# Altium project GJJ真正的大作业.PrjPcb
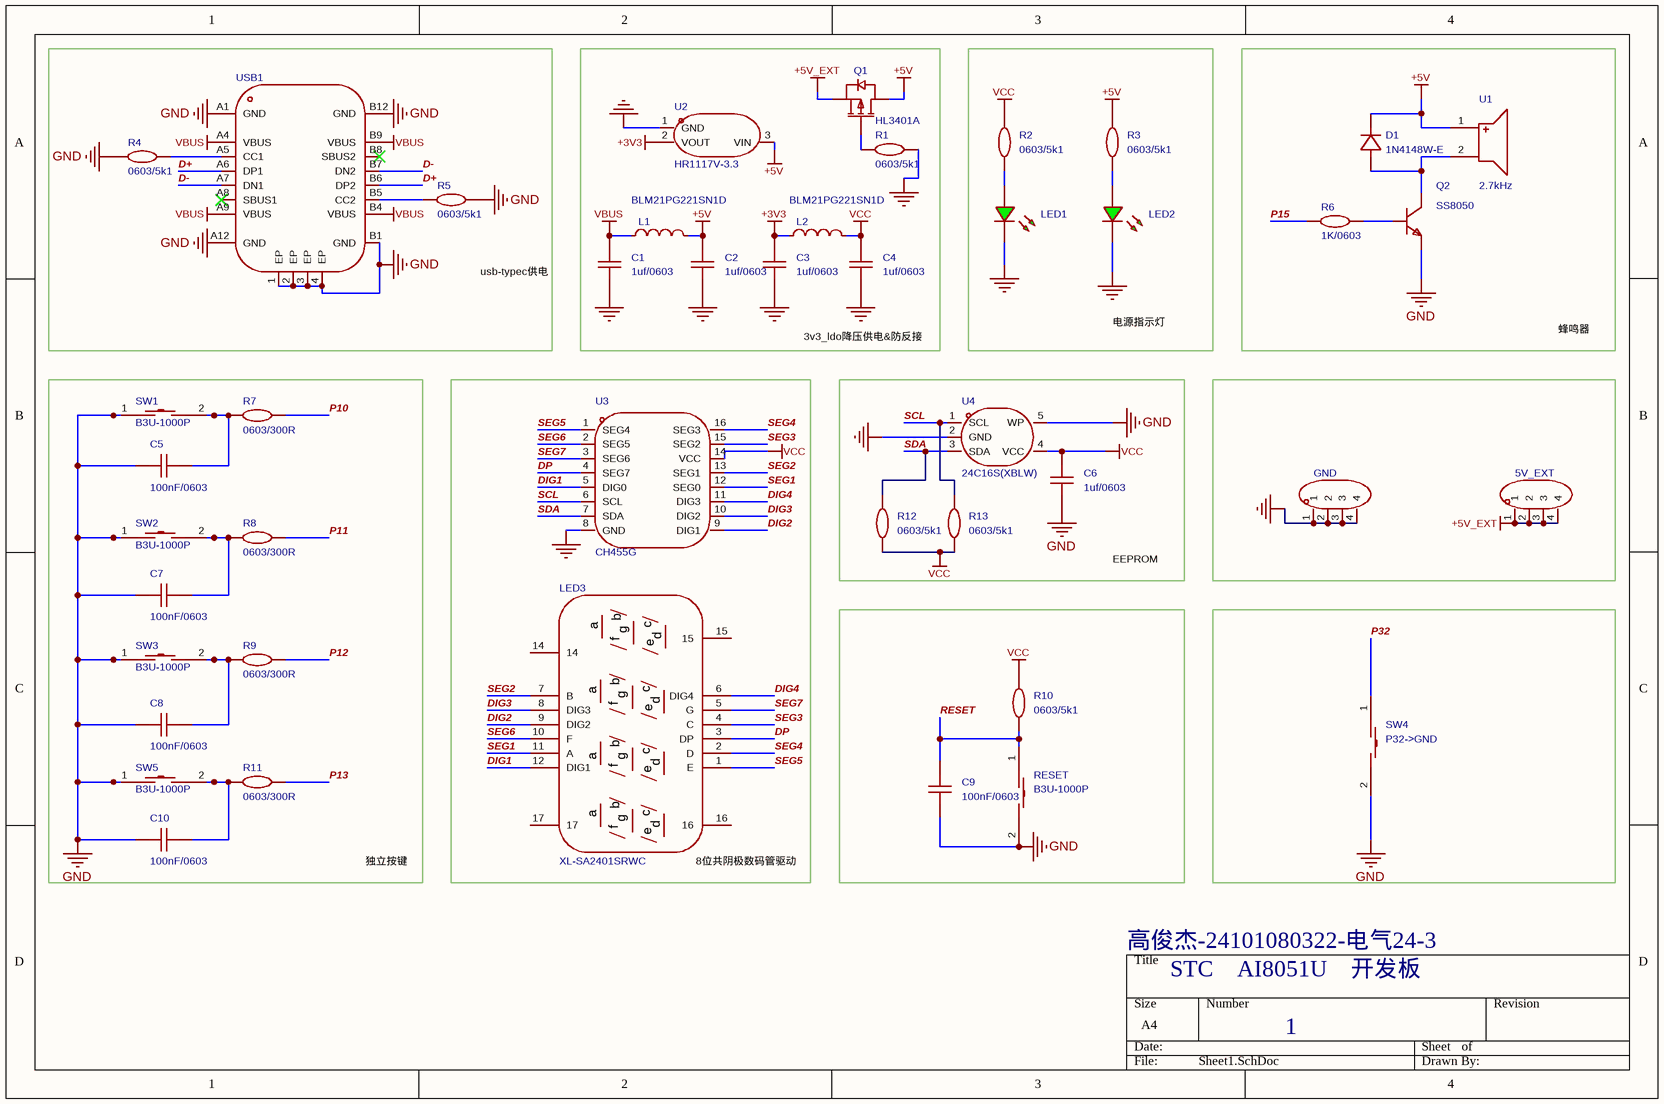
[diagram p0: Sheet1.SchDoc]
2 sheets, 48 parts. Net scope: global (net labels, ports and power ports of the same name join across sheets).
Board file: PCB1.PcbDoc
Sheets:
  Sheet1.SchDoc
  Sheet2.SchDoc

## Sheet Sheet1.SchDoc
size A4; SheetNumber: 1; SheetTotal: 2

### Parts
5V_EXT  (no value)  [HDR-TH_4P-P2.54-V-F]
C1  1uf/0603  [C0603]
C2  1uf/0603  [C0603]
C3  1uf/0603  [C0603]
C4  1uf/0603  [C0603]
C5  100nF/0603  [C0603]
C6  1uf/0603  [C0603]
C7  100nF/0603  [C0603]
C8  100nF/0603  [C0603]
C9  100nF/0603  [C0603]
C10  100nF/0603  [C0603]
D1  1N4148W-E  [SOD-123_L2.8-W1.6-LS3.7-RD]
GND  (no value)  [HDR-TH_4P-P2.54-V-F]
L1  BLM21PG221SN1D  [L0805]
L2  BLM21PG221SN1D  [L0805]
LED1  (no value)  [LED_0603]
LED2  (no value)  [LED_0603]
LED3  XL-SA2401SRWC  [LED-SEG-SMD_12P-L28.5-W10.0-P2.54]
Q1  HL3401A  [SOT-23-3_L2.9-W1.3-P1.90-LS2.4-BR]
Q2  SS8050  [SOT-23-3_L2.9-W1.3-P1.90-LS2.4-BR]
R1  0603/5k1  [R0603]
R2  0603/5k1  [R0603]
R3  0603/5k1  [R0603]
R4  0603/5k1  [R0603]
R5  0603/5k1  [R0603]
R6  1K/0603  [R0603]
R7  0603/300R  [R0603]
R8  0603/300R  [R0603]
R9  0603/300R  [R0603]
R10  0603/5k1  [R0603]
R11  0603/300R  [R0603]
R12  0603/5k1  [R0603]
R13  0603/5k1  [R0603]
RESET  B3U-1000P  [KEY-SMD_B3U-1000PM]
SW1  B3U-1000P  [KEY-SMD_B3U-1000PM]
SW2  B3U-1000P  [KEY-SMD_B3U-1000PM]
SW3  B3U-1000P  [KEY-SMD_B3U-1000PM]
SW4  P32->GND  [KEY-SMD_B3U-1000PM]
SW5  B3U-1000P  [KEY-SMD_B3U-1000PM]
U1  2.7kHz  [BUZ-SMD_L9.7-W9.7]
U2  HR1117V-3.3  [SOT-89-3_L4.5-W2.4-P1.50-LS4.0-BR]
U3  CH455G  [SOP-16_L10.0-W3.9-P1.27-LS6.0-BL]
U4  24C16S(XBLW)  [SOT-23-5_L2.9-W1.6-P0.95-LS2.8-BL]
USB1  (no value)  [USB_TYPE-C-16P]

### Blocks framed on the sheet
usb-typec供电: R4 R5 USB1
3v3_ldo降压供电&防反接: C1-C4 L1 L2 Q1 R1 U2
电源指示灯: LED1 LED2 R2 R3
蜂鸣器: D1 Q2 R6 U1
独立按键: C5 C7 C8 C10 R7-R9 R11 SW1-SW3 SW5
8位共阴极数码管驱动: LED3 U3
EEPROM: C6 R12 R13 U4

### Nets
+3V3: C3.2 L2.1 U2.2(VOUT)
+5V: C2.2 D1.1(C) L1.2 Q1.3(D) R3.2 U1.1 U2.3(VIN)
+5V_EXT: 5V_EXT.1 5V_EXT.2 5V_EXT.3 5V_EXT.4 Q1.2(S)
GND: C1.1 C2.1 C3.1 C4.1 C5.1 C6.1 C7.1 C8.1 C9.1 C10.1 GND.1 GND.2 GND.3 GND.4 LED1.1(C) LED2.1(C) Q2.2(E) R1.2 R4.1 R5.2 RESET.2 SW1.1 SW2.1 SW3.1 SW4.2 SW5.1 U2.1(GND) U3.8(GND) U4.2(GND) U4.5(WP) USB1.1(EP) USB1.2(EP) USB1.3(EP) USB1.4(EP) USB1.A1(GND) USB1.A12(GND) USB1.B1(GND) USB1.B12(GND)
VBUS: C1.2 L1.1 USB1.A4(VBUS) USB1.A9(VBUS) USB1.B4(VBUS) USB1.B9(VBUS)
VCC: C4.2 C6.2 L2.2 R2.2 R10.2 R12.1 R13.1 U3.14(VCC) U4.4(VCC)
D+: USB1.A6(DP1) USB1.B6(DP2)
D-: USB1.A7(DN1) USB1.B7(DN2)
DIG1: LED3.12(DIG1) U3.5(DIG0)
DIG2: LED3.9(DIG2) U3.9(DIG1)
DIG3: LED3.8(DIG3) U3.10(DIG2)
DIG4: LED3.6(DIG4) U3.11(DIG3)
DP: LED3.3(DP) U3.4(SEG7)
P10: R7.2
P11: R8.2
P12: R9.2
P13: R11.2
P15: R6.1
P32: SW4.1
RESET: C9.2 R10.1 RESET.1
SCL: R13.2 U3.6(SCL) U4.1(SCL)  [project net P24]
SDA: R12.2 U3.7(SDA) U4.3(SDA)  [project net P23]
SEG1: LED3.11(A) U3.12(SEG0)
SEG2: LED3.7(B) U3.13(SEG1)
SEG3: LED3.4(C) U3.15(SEG2)
SEG4: LED3.2(D) U3.16(SEG3)
SEG5: LED3.1(E) U3.1(SEG4)
SEG6: LED3.10(F) U3.2(SEG5)
SEG7: LED3.5(G) U3.3(SEG6)
NetC5_2: C5.2 R7.1 SW1.2
NetC7_2: C7.2 R8.1 SW2.2
NetC8_2: C8.2 R9.1 SW3.2
NetC10_2: C10.2 R11.1 SW5.2
NetD1_2: D1.2(A) Q2.3(C) U1.2
NetLED1_2: LED1.2(A) R2.1
NetLED2_2: LED2.2(A) R3.1
NetQ1_1: Q1.1(G) R1.1
NetQ2_1: Q2.1(B) R6.2
NetR4_2: R4.2 USB1.A5(CC1)
NetR5_1: R5.1 USB1.B5(CC2)

Not connected (* = marked no-connect by the designer): LED3 14 15 16 17; USB1 A8(SBUS1)* B8(SBUS2)*

### Notes on the sheet
- 高俊杰-24101080322-电气24-3
- STC    AI8051U    开发板
- 1
- (in symbol XL-SA2401SRWC) b; a; g; c; f; d; e

### Library data of the parts
5V_EXT GND = HDR-F_2.54_1x4P: Symbol: 2.54-1*4P母; ConvertToPcb: yes; ModelId: d187812051054f85879fcaa51a310d8e聨0819f05c4eef4c71ace90d822a990e87; ModelTransform: 419.6842,98.464,0,0,0,0,0,0,-118.11; Device: HDR-F_2.54_1x4P; AddInBom: yes; SupplierPart: C2718488; Supplier Footprint: 插件; FootprintName: HDR-TH_4P-P2.54-V-F; ModelName: HDR-TH_4P-P2.54-V-F
C1-C10 = CAP_0603: Symbol: Capacitance; 3D Model: ac125912035d415993ca9572d50418b1聨0819f05c4eef4c71ace90d822a990e87; 3D Model Transform: 62.992,31.496,0,0,0,0,0,0,0; ConvertToPcb: yes; ModelName: C0603_L1.6-W0.8-H0.8; Device: CAP_0603; Supplier Footprint: 0603; AddInBom: yes; FootprintName: C0603
  C1-C4 C6: Value: 1uf/0603
  C5 C7-C10: Value: 100nF/0603
D1 = 1N4148W-E: 二极管配置:-;正向压降(Vf):-;直流反向耐压(Vr):-;; Manufacturer: MDD(辰达半导体); 3D Model: 73858e86c18848f5a81710cfe7352ee5; 3D Model Transform: 145.669,70.3249,0,0,0,0,0,0,0; AddInBom: yes; Symbol: 1n4148w-e; Device: 1N4148W-E; LCSC Part Name: 开关二极管; Supplier Part: C41371420; Manufacturer Part: 1N4148W-E; Supplier Footprint: SOD-123; JLCPCB Part Class: 扩展库; Datasheet: https://atta.szlcsc.com/upload/public/pdf/source/20240830/DACFAB1CEFECD76C0C0B0085B83E27DC.pdf; Supplier: LCSC; Diode Configuration: -; Forward Voltage (Vf@If): -; Reverse Voltage (Vr): -; ConvertToPcb: yes; FootprintName: SOD-123_L2.8-W1.6-LS3.7-RD; ModelName: SOD-123_L2.8-W1.6-LS3.7-RD
L1 L2 = BLM21PG221SN1D: 阻抗@频率:220Ω@100MHz;误差:±25%;直流电阻(DCR):45mΩ;; Manufacturer: muRata(村田); AddInBom: yes; ModelId: 37a81e68749a4138bd2dfa6897b24b85聨0819f05c4eef4c71ace90d822a990e87; ModelName: R0805_L2.0-W1.3-H0.6; ModelTransform: 78.74,51.181,0,0,0,0,0,0.001,0; Tolerance: ±25%; DC Resistance(DCR): 45mΩ; Current Rating: 2A; Number of Circuits: 1; Symbol: BLM21PG221SN1D; Device: BLM21PG221SN1D; LCSC Part Name: 单路 0805磁珠 阻抗220Ω@100MHz; SupplierPart: C85840; ManufacturerPart: BLM21PG221SN1D; Supplier Footprint: 0805; JLCPCB Part Class: Extended Part; Datasheet: https://item.szlcsc.com/datasheet/BLM21PG221SN1D/87016.html; Supplier: LCSC; ConvertToPcb: yes; FootprintName: L0805; Impedance @ Frequency: 220Ω@100MHz; Operating Temperature: -55℃~+125℃
LED1 LED2 = LED_0603-G: Symbol: LED_G_OLD; Convert to PCB: yes; 3D Model: 8b5fcaf0229049f8a37a9c352bb0ca0a聨0819f05c4eef4c71ace90d822a990e87; 3D Model Transform: 63.1,31.6,23.7,0,0,0,0,0,0; ModelName: LED-0603_G; Device: LED_0603-G; Add into BOM: yes; Supplier Footprint: 0603; FootprintName: LED_0603
LED3 = XL-SA2401SRWC: 数码管位数:4位;字符尺寸(英寸):0.2;LED极性:共阴;发光颜色:红色;耗散功率(Pd):36mW;; Manufacturer: XINGLIGHT(成兴光); AddInBom: yes; ModelId: 84030f14c7a848788791f3033a3ddaf3聨0819f05c4eef4c71ace90d822a990e87; ModelTransform: 1122.045,393.7,0,0,0,0,0,0,0; Number of Characters: 4位; Digit/Alpha Size(inch): 0.2; Display Type: 7段; LED Polarity: 共阴; Illumination Color: 红色; Light Intensity: 100mcd; Forward Voltage Drop: 1.8V; Pd - Power Dissipation: 36mW; Symbol: XL-SA2401SRWC; Device: XL-SA2401SRWC; LCSC Part Name: 0.2英寸红色四位共阴数码管; SupplierPart: C49652871; ManufacturerPart: XL-SA2401SRWC; Supplier Footprint: SMD; JLCPCB Part Class: Extended Part; Datasheet: https://item.szlcsc.com/datasheet/XL-SA2401SRWC/52210392.html; Supplier: LCSC; ConvertToPcb: yes; FootprintName: LED-SEG-SMD_12P-L28.5-W10.0-P2.54; ModelName: LED-SEG-SMD_12P-L28.5-W10.0-P2.54; Operating Temperature: -30℃~+70℃; Length: -; Width: -; Height: -
Q1 = HL3401A: 数量:1个P沟道;漏源电压(Vdss):30V;连续漏极电流(Id):4.2A;导通电阻(RDS(on)):50mΩ@10V;耗散功率(Pd):350mW;阈值电压(Vgs(th)):900mV@250uA;; Manufacturer: R+O(宏嘉诚); AddInBom: yes; ModelId: c62791f0466c4ae2a892c056b845b0ca聨0819f05c4eef4c71ace90d822a990e87; ModelName: SOT-23-3P_L2.9-W1.3-H1.0-LS2.4-P0.95; ModelTransform: 98.425,114.173,0,180,0,0,0.0005,-0.0005,0; Number: 1个P沟道; Drain to Source Voltage: 30V; Current - Continuous Drain(Id): 4.2A; Pd - Power Dissipation: 350mW; Gate Charge(Qg): 22nC@10V; Input Capacitance(Ciss): 954pF; Reverse Transfer Capacitance (Crss@Vds): 77pF; Type: P沟道; Output Capacitance(Coss): 115pF; Symbol: HL3401A; Device: HL3401A; LCSC Part Name: 1个P沟道 耐压:30V 电流:4.2A; SupplierPart: C7420349; ManufacturerPart: HL3401A; Supplier Footprint: SOT-23; JLCPCB Part Class: Extended Part; Datasheet: https://item.szlcsc.com/datasheet/HL3401A/8397171.html; Supplier: LCSC; ConvertToPcb: yes; FootprintName: SOT-23-3_L2.9-W1.3-P1.90-LS2.4-BR; RDS(on): 50mΩ@10V; Gate Threshold Voltage (Vgs(th)): 900mV@250uA; Operating Temperature: -55℃~+150℃
Q2 = SS8050_C2150: 晶体管类型:NPN;集电极电流(Ic):1.5A;集射极击穿电压(Vceo):25V;功率(Pd):300mW;直流电流增益(hFE@Ic,Vce):200@100mA,1V;; Manufacturer: CJ(江苏长电/长晶); 3D Model: c62791f0466c4ae2a892c056b845b0ca; 3D Model Transform: 98.425,114.173,0,180,0,0,0.0005,-0.0005,0; Transistor Type: NPN; Collector Current (Ic): 1.5A; Collector-Emitter Breakdown Voltage (Vceo): 25V; Power Dissipation (Pd): 300mW; Transition Frequency (fT): 100MHz; Collector Cut-Off Current (Icbo): 100nA; Collector-Emitter Saturation Voltage (VCE(sat)@Ic,Ib): 500mV@800mA,80mA; AddInBom: yes; ModelName: SOT-23-3P_L2.9-W1.3-H1.0-LS2.4-P0.95; Symbol: SS8050_C2150; Device: SS8050_C2150; LCSC Part Name: SS8050(RANGE:200-350) hfe=200~350; Supplier Part: C2150; Manufacturer Part: SS8050; Supplier Footprint: SOT-23; Datasheet: https://atta.szlcsc.com/upload/public/pdf/source/20230322/AEE86F4B043774EFF80CAEA14A37D9E9.pdf; Supplier: LCSC; DC Current Gain (hFE@Ic,Vce): 200@100mA,1V; Operating Temperature: -; ConvertToPcb: yes; FootprintName: SOT-23-3_L2.9-W1.3-P1.90-LS2.4-BR
R1-R13 = Res_0603: Symbol: 电阻; ConvertToPcb: yes; ModelId: fc143cca1e79419f9cd78b61e9279f08聨0819f05c4eef4c71ace90d822a990e87; ModelTransform: 31.8897,63.7794,0,90,0,0,0,0,0; Device: Res_0603; AddInBom: yes; Supplier Footprint: 0603; FootprintName: R0603; ModelName: R0603
  R1-R5 R10 R12 R13: Value: 0603/5k1
  R6: Value: 1K/0603
  R7-R9 R11: Value: 0603/300R
RESET SW1-SW5 = B3U-1000P: 电路结构:单刀单掷;按钮形状:圆形按钮;作用力:1.53N;安装方式:立贴;开关长度:3mm;开关宽度:2.5mm;开关高度:1.6mm;触点电流:50mA;额定电压:12V;带灯:-;工作寿命:-;; Manufacturer: OMRON(欧姆龙); AddInBom: yes; ModelId: 4a122f942e8c428cab657e97b0b9ae70聨0819f05c4eef4c71ace90d822a990e87; ModelName: KEY-SMD_2P-L3.0-W2.5-H1.6-LS4.0; ModelTransform: 157.48,98.425,0,0,0,0,0,0,0; Circuit: 单刀单掷; Actuator Style: 圆形按钮; Operating Force: 1.53N; Switch Height: 1.6mm; Contact Current: 50mA; Voltage Rating: 12V; Symbol: B3U-1000P; Device: B3U-1000P; LCSC Part Name: 3*2.5*1.6mm 立贴 轻触开关; SupplierPart: C231329; ManufacturerPart: B3U-1000P; Supplier Footprint: SMD,2.5x3mm; JLCPCB Part Class: Extended Part; Datasheet: https://item.szlcsc.com/datasheet/B3U-1000P/231216.html; Supplier: LCSC; ConvertToPcb: yes; FootprintName: KEY-SMD_B3U-1000PM; Mounting Type: 立贴; Length: 3mm; Width: 2.5mm; With Lamp: -; Termination Style: SMD接片; Life: -; Operating Temperature: -25℃~+70℃
U1 = CMI-9705-0580-SMT-TR: 驱动方式:有源(内含驱动线路);构造类型:电磁式;额定电压:5V;频率:2.7kHz;声压(SPL):80dB;; Manufacturer: CUI; AddInBom: yes; ModelId: 4d30b5b9f6214c52b026a489d6e841ad聨0819f05c4eef4c71ace90d822a990e87; ModelTransform: 382.283,397.637,0,0,0,0,0,-0.001,0; Voltage Rating: 5V; Voltage - Supply: 3V~8V; Current Consumption: 30mA; Sound Pressure Level(SPL): 80dB; Symbol: CMI-9705-0580-SMT-TR; Device: CMI-9705-0580-SMT-TR; LCSC Part Name: 磁性蜂鸣器指示器，表面贴装，内部驱动; SupplierPart: C22359716; ManufacturerPart: CMI-9705-0580-SMT-TR; Supplier Footprint: SMD,9.7x9.7mm; JLCPCB Part Class: Extended Part; Datasheet: https://item.szlcsc.com/datasheet/CMI-9705-0580-SMT-TR/23802189.html; Supplier: LCSC; ConvertToPcb: yes; FootprintName: BUZ-SMD_L9.7-W9.7; ModelName: BUZ-SMD_L9.7-W9.7; Driver Circuitry: 有源(内含驱动线路); Technology: 电磁式; Value: 2.7kHz; Diameter(φD): -; Length: -; Width: -; Height: -; Operating Temperature: -; Mounting Type: -; Lead Pitch: -; Continuous Operating Time: -
U2 = HR1117V-3.3: 输出极性:正极;工作电压:15V;输出电压:3.3V;输出电流:1A;电源纹波抑制比(PSRR):-;输出类型:固定;; Manufacturer: R+O(宏嘉诚); AddInBom: yes; ModelId: dde435042bae4b9691e74da94cf9d9f3聨0819f05c4eef4c71ace90d822a990e87; ModelTransform: 177.165,161.417,0,90,0,0,-2.323,0,0; Output Configuration: 正极; Voltage - Supply: 15V; Output Voltage: 3.3V; Output Current: 1A; Voltage Dropout: 1.1V@(1A); standby current: 2mA; Noise: 0.003%Vout; Output Type: 固定; Number of Outputs: 1; Symbol: HR1117V-3.3; Device: HR1117V-3.3; LCSC Part Name: 低压差线性稳压器，分固定电压输出和可调电压输出版本; SupplierPart: C54560864; ManufacturerPart: HR1117V-3.3; Supplier Footprint: SOT-89; JLCPCB Part Class: Extended Part; Datasheet: https://item.szlcsc.com/datasheet/HR1117V-3.3/57930308.html; Supplier: LCSC; ConvertToPcb: yes; FootprintName: SOT-89-3_L4.5-W2.4-P1.50-LS4.0-BR; ModelName: SOT-89-3_L4.5-W2.4-P1.50-LS4.0-BR; Power Supply Rejection Ratio (PSRR): -; Features: 热关断; Operating Temperature: -40℃~+85℃
U3 = CH455G: 接口类型:I2C;工作电压:2.7V~5V;时钟频率(fc):4MHz;位驱动电流:160mA;段驱动电流:25mA;; Manufacturer: WCH(南京沁恒); AddInBom: yes; ModelId: 3361a6792abf4a8f8fbca4f1924a67ee聨0819f05c4eef4c71ace90d822a990e87; ModelName: SOP-16_L9.9-W3.9-H1.5-LS6.0-P1.27; ModelTransform: 240.39054,393.7,0,90,0,0,0,0,0; Configuration: 7段x4位；8段x4位; Interface: I2C; Clock Frequency: 4MHz; Quiescent Current: 50uA; Digit Drive Current: 160mA; Segment Drive Current: 25mA; Symbol: CH455G; Device: CH455G; LCSC Part Name: 数码管驱动及键盘控制芯片; SupplierPart: C89818; ManufacturerPart: CH455G; Supplier Footprint: SOP-16; JLCPCB Part Class: Extended Part; Datasheet: https://item.szlcsc.com/datasheet/CH455G/91000.html; Supplier: LCSC; ConvertToPcb: yes; FootprintName: SOP-16_L10.0-W3.9-P1.27-LS6.0-BL; Voltage - Supply: 2.7V~5V; Features: 键盘扫描；共阴极；辉光可调; Operating Temperature: -40℃~+85℃; Pd - Power Dissipation: -
U4 = 24C16S(XBLW): 接口类型:I2C;存储容量:16Kbit;时钟频率(fc):1MHz;; Manufacturer: XBLW(芯伯乐); AddInBom: yes; ModelId: 018c57e721114987ae90467fe9f1d259聨0819f05c4eef4c71ace90d822a990e87; ModelTransform: 114.96,110.236,0,0,0,0,0,0,0; Interface: I2C; Memory Size: 16Kbit; Clock Frequency: 1MHz; Write Cycle Time(Tw): 5ms; Data Retention - TDR (Year): 100年; Write Cycle Endurance: 100万次; Voltage - Supply: 1.8V~5.5V; Symbol: 24C16S(XBLW); Device: 24C16S(XBLW); LCSC Part Name: 16Kbit 串行EEPROM; SupplierPart: C41408503; ManufacturerPart: 24C16S(XBLW); Supplier Footprint: SOT-23-5; JLCPCB Part Class: Extended Part; Datasheet: https://item.szlcsc.com/datasheet/24C16S(XBLW)/43210132.html; Supplier: LCSC; ConvertToPcb: yes; FootprintName: SOT-23-5_L2.9-W1.6-P0.95-LS2.8-BL; ModelName: SOT-23-5_L2.9-W1.6-P0.95-LS2.8-BL; Features: 内置上电复位(POR)；硬件写保护功能；噪声抑制功能; Operating Temperature: -40℃~+85℃
USB1 = USB_TYPE-C-16P: AddInBom: yes; ModelId: 35058e297fd54ee2afd2de30c3ce7155聨0819f05c4eef4c71ace90d822a990e87; ModelName: USB-C_SMD-TYPE-C-31-M-12; ModelTransform: 360,318.121,0,180,0,0,0,-41.02,-39.37; Symbol: USB_TYPE-C-16P; Device: USB_TYPE-C-16P; Supplier Footprint: SMD; ConvertToPcb: yes; FootprintName: USB_TYPE-C-16P

## Sheet Sheet2.SchDoc
size A4; SheetNumber: 2; SheetTotal: 2
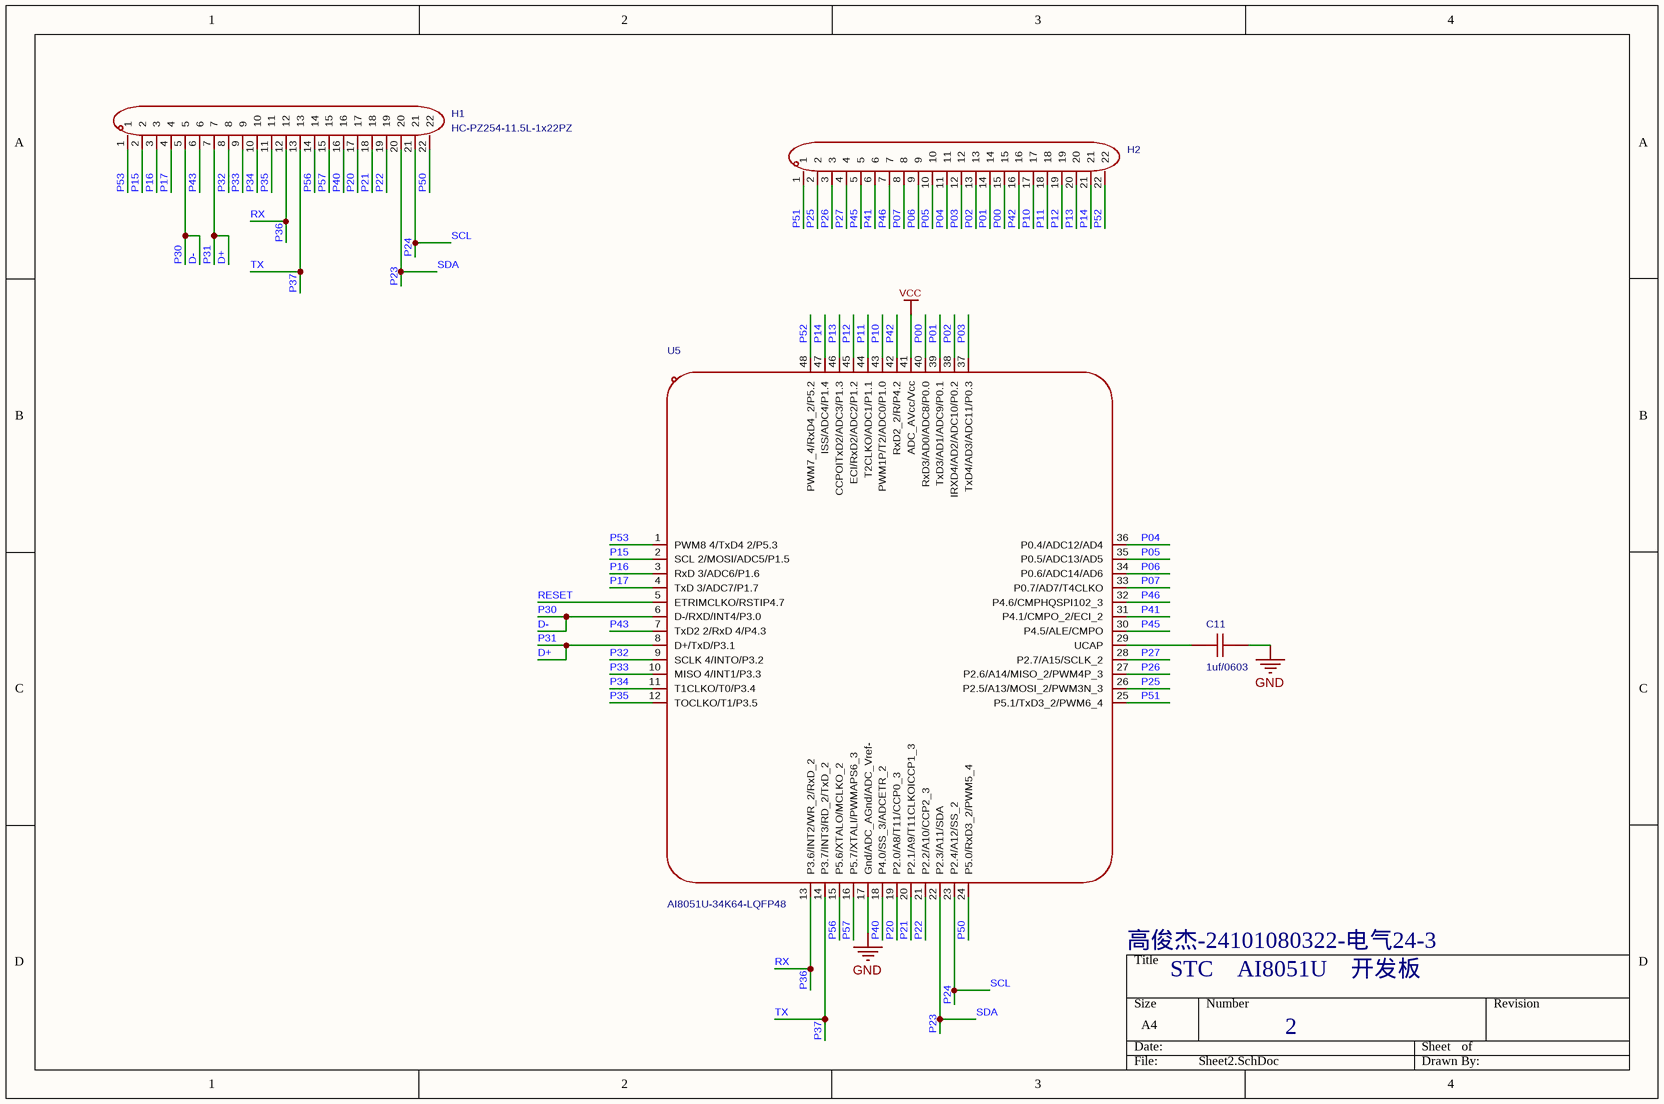
[diagram p1: Sheet2.SchDoc]

### Parts
C11  1uf/0603  [C0603]
H1  HC-PZ254-11.5L-1x22PZ  [HDR-TH_22P-P2.54-V-M]
H2  HC-PZ254-11.5L-1x22PZ  [HDR-TH_22P-P2.54-V-M]  (value not drawn)
U5  AI8051U-34K64-LQFP48  [LQFP-48_L7.0-W7.0-P0.50-LS9.0-BL]

### Nets
GND: C11.1 U5.17(Gnd/ADC_AGnd/ADC_Vref-)
VCC: U5.41(ADC_AVcc/Vcc)
D+: H1.7 U5.8(D+/TxD/P3.1)  [also labelled P31]
D-: H1.5 U5.6(D-/RXD/INT4/P3.0)  [also labelled P30]
P00: H2.15 U5.40(RxD3/AD0/ADC8/P0.0)
P01: H2.14 U5.39(TxD3/AD1/ADC9/P0.1)
P02: H2.13 U5.38(IRXD4/AD2/ADC10/P0.2)
P03: H2.12 U5.37(TxD4/AD3/ADC11/P0.3)
P04: H2.11 U5.36(P0.4/ADC12/AD4)
P05: H2.10 U5.35(P0.5/ADC13/AD5)
P06: H2.9 U5.34(P0.6/ADC14/AD6)
P07: H2.8 U5.33(P0.7/AD7/T4CLKO)
P10: H2.17 U5.43(PWM1P/T2/ADC0/P1.0)
P11: H2.18 U5.44(T2CLKO/ADC1/P1.1)
P12: H2.19 U5.45(ECI/RxD2/ADC2/P1.2)
P13: H2.20 U5.46(CCPOITxD2/ADC3/P1.3)
P14: H2.21 U5.47(ISS/ADC4/P1.4)
P15: H1.2 U5.2(SCL_2/MOSI/ADC5/P1.5)
P16: H1.3 U5.3(RxD_3/ADC6/P1.6)
P17: H1.4 U5.4(TxD_3/ADC7/P1.7)
P20: H1.17 U5.19(P2.0/A8/T11/CCP0_3)
P21: H1.18 U5.20(P2.1/A9/T11CLKOICCP1_3)
P22: H1.19 U5.21(P2.2/A10/CCP2_3)
P23: H1.20 U5.22(P2.3/A11/SDA)  [also labelled SDA]
P24: H1.21 U5.23(P2.4/A12/SS_2)  [also labelled SCL]
P25: H2.2 U5.26(P2.5/A13/MOSI_2/PWM3N_3)
P26: H2.3 U5.27(P2.6/A14/MISO_2/PWM4P_3)
P27: H2.4 U5.28(P2.7/A15/SCLK_2)
P32: H1.8 U5.9(SCLK_4/INTO/P3.2)
P33: H1.9 U5.10(MISO_4/INT1/P3.3)
P34: H1.10 U5.11(T1CLKO/T0/P3.4)
P35: H1.11 U5.12(TOCLKO/T1/P3.5)
P36: H1.12 U5.13(P3.6/INT2/WR_2/RxD_2)  [also labelled RX]
P37: H1.13 U5.14(P3.7/INT3/RD_2/TxD_2)  [also labelled TX]
P40: H1.16 U5.18(P4.0/SS_3/ADCETR_2)
P41: H2.6 U5.31(P4.1/CMPO_2/ECI_2)
P42: H2.16 U5.42(RxD2_2/R/P4.2)
P43: H1.6 U5.7(TxD2_2/RxD_4/P4.3)
P45: H2.5 U5.30(P4.5/ALE/CMPO)
P46: H2.7 U5.32(P4.6/CMPHQSPI102_3)
P50: H1.22 U5.24(P5.0/RxD3_2/PWM5_4)
P51: H2.1 U5.25(P5.1/TxD3_2/PWM6_4)
P52: H2.22 U5.48(PWM7_4/RxD4_2/P5.2)
P53: H1.1 U5.1(PWM8_4/TxD4_2/P5.3)
P56: H1.14 U5.15(P5.6/XTALO/MCLKO_2)
P57: H1.15 U5.16(P5.7/XTALI/PWMAPS6_3)
RESET: U5.5(ETRIMCLKO/RSTIP4.7)
NetC11_2: C11.2 U5.29(UCAP)

### Notes on the sheet
- (near U5) 高俊杰-24101080322-电气24-3
- STC    AI8051U    开发板
- 2

### Library data of the parts
C11 = CAP_0603: as C1 on sheet Sheet1; Device: CAP_0603; Supplier Footprint: 0603; Value: 1uf/0603; AddInBom: yes; FootprintName: C0603
H1 H2 = HC-PZ254-11.5L-1x22PZ: 插针结构:1x22P;间距:2.54mm;行距:-;圆针/方针:方针;安装方式:直插;排数:单排;总PIN位数:22P;额定电流:3A;额定电压:-;配合针长度:6mm;塑高:2.5mm;端接针长度:3mm;触头材质:黄铜;触头镀层:金;工作温度:-40℃~+105℃;颜色:黑色;; Manufacturer: HC(虹成电子); AddInBom: yes; ModelId: 875f4c094945453e8148e92095c9b8a7聨0819f05c4eef4c71ace90d822a990e87; ModelName: HDR-TH_22P-P2.54-M-LI-1X22P; ModelTransform: 2199.99552,98.425,0,0,0,0,0,0,-118.11; Pin Structure: 1x22P; Pitch: 2.54mm; Circluar Pins/Square Pins: 方针; Current Rating: 3A; Symbol: HC-PZ254-11.5L-1X22PZ; Device: HC-PZ254-11.5L-1x22PZ; LCSC Part Name: 1x22P 间距:2.54mm 方针 直插; SupplierPart: C41375941; ManufacturerPart: HC-PZ254-11.5L-1x22PZ; Supplier Footprint: 插件,P=2.54mm; JLCPCB Part Class: Extended Part; Datasheet: https://item.szlcsc.com/datasheet/HC-PZ254-11.5L-1x22PZ/43143790.html; Supplier: LCSC; ConvertToPcb: yes; FootprintName: HDR-TH_22P-P2.54-V-M; Row Spacing: -; Mounting Type: 直插; Number of Rows: 单排; Number of Pins: 22P; Voltage Rating (Max): -; Length of Mating Pin: 6mm; Insulation Height: 2.5mm; Length of End Connection Pin: 3mm; Contact Material: 黄铜; Contact Plating: 金; Operating Temperature: -40℃~+105℃; Color: 黑色
U5 = AI8051U-34K64-LQFP48: 硬件浮点/硬件三角函数 跑100MHz, 32位8051-CPU 跑 44MHz，PWM 有硬件移相功能，DMA支持外设到外设，DMA支持PWM; Manufacturer: STC; AddInBom: yes; ModelId: 093be70396ff421eb2cdb946d5311efc聨0819f05c4eef4c71ace90d822a990e87; ModelName: LQFP-48_L7.0-W7.0-H1.4-LS9.0-P0.50; ModelTransform: 354.331,354.331,0,0,0,0,0,0,0; Symbol: AI8051U-34K64-LQFP48; Device: AI8051U-34K64-LQFP48; LCSC Part Name: 单片机(MCU/MPU/SOC); SupplierPart: C42388168; ManufacturerPart: AI8051U-34K64-LQFP48; Supplier Footprint: LQFP-48(7x7); JLCPCB Part Class: Extended Part; Datasheet: https://item.szlcsc.com/datasheet/AI8051U-34K64-LQFP48/44315053.html; Supplier: LCSC; ConvertToPcb: yes; FootprintName: LQFP-48_L7.0-W7.0-P0.50-LS9.0-BL

## Nets that join several sheets
GND: Sheet1 (38 pins), Sheet2 (C11.1 U5.17)
VCC: Sheet1 (9 pins), Sheet2 (U5.41)
D+: Sheet1 (USB1.A6 USB1.B6), Sheet2 (H1.7 U5.8)
D-: Sheet1 (USB1.A7 USB1.B7), Sheet2 (H1.5 U5.6)
P10: Sheet1 (R7.2), Sheet2 (H2.17 U5.43)
P11: Sheet1 (R8.2), Sheet2 (H2.18 U5.44)
P12: Sheet1 (R9.2), Sheet2 (H2.19 U5.45)
P13: Sheet1 (R11.2), Sheet2 (H2.20 U5.46)
P15: Sheet1 (R6.1), Sheet2 (H1.2 U5.2)
P23: Sheet1 (R12.2 U3.7 U4.3), Sheet2 (H1.20 U5.22)
P24: Sheet1 (R13.2 U3.6 U4.1), Sheet2 (H1.21 U5.23)
P32: Sheet1 (SW4.1), Sheet2 (H1.8 U5.9)
RESET: Sheet1 (C9.2 R10.1 RESET.1), Sheet2 (U5.5)